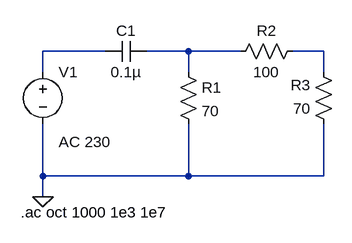
[diagram p0: schematic Draft2.asc]
Draft2.asc, the LTspice schematic file:
Version 4
SHEET 1 880 680
WIRE 176 128 80 128
WIRE 304 128 240 128
WIRE 384 128 304 128
WIRE 512 128 464 128
WIRE 80 160 80 128
WIRE 304 160 304 128
WIRE 512 160 512 128
WIRE 80 320 80 240
WIRE 304 320 304 240
WIRE 304 320 80 320
WIRE 512 320 512 240
WIRE 512 320 304 320
WIRE 80 352 80 320
FLAG 80 352 0
SYMBOL cap 240 112 R90
WINDOW 0 0 32 VBottom 2
WINDOW 3 32 32 VTop 2
SYMATTR InstName C1
SYMATTR Value 0.1µ
SYMBOL res 288 144 R0
SYMATTR InstName R1
SYMATTR Value 70
SYMBOL voltage 80 144 R0
WINDOW 123 24 124 Left 2
WINDOW 39 0 0 Left 2
SYMATTR InstName V1
SYMATTR Value ""
SYMATTR Value2 AC 230
SYMBOL res 480 112 R90
WINDOW 0 0 56 VBottom 2
WINDOW 3 32 56 VTop 2
SYMATTR InstName R2
SYMATTR Value 100
SYMBOL res 528 256 R180
WINDOW 0 36 76 Left 2
WINDOW 3 36 40 Left 2
SYMATTR InstName R3
SYMATTR Value 70
TEXT 46 376 Left 2 !.ac oct 1000 1e3 1e7

The netlist it stands for:
* Draft2.asc
C1 N002 N001 0.1µ
R1 N002 0 70
V1 N001 0 AC 230
R2 N003 N002 100
R3 0 N003 70
.ac oct 1000 1e3 1e7
.backanno
.end